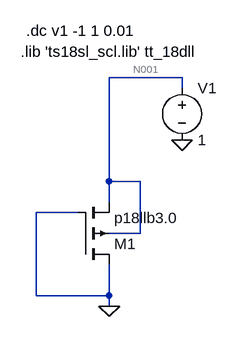
[diagram p0: schematic psuedo.asc]
psuedo.asc, the LTspice schematic file:
Version 4
SHEET 1 880 680
WIRE 352 128 240 128
WIRE 352 144 352 128
WIRE 240 288 240 128
WIRE 288 288 240 288
WIRE 240 320 240 288
WIRE 192 336 128 336
WIRE 288 368 288 288
WIRE 288 368 240 368
WIRE 128 464 128 336
WIRE 240 464 240 416
WIRE 240 464 128 464
WIRE 240 480 240 464
FLAG 240 480 0
FLAG 352 224 0
SYMBOL voltage 352 128 R0
WINDOW 123 0 0 Left 0
WINDOW 39 0 0 Left 0
SYMATTR InstName V1
SYMATTR Value 1
SYMBOL pmos4 192 416 M180
SYMATTR InstName M1
SYMATTR Value p18llb3.0
SYMATTR Value2 l=4u w=4u ad=1.8p as=1.8p pd=8.9u ps=8.9u
TEXT 104 88 Left 2 !.lib 'ts18sl_scl.lib' tt_18dll
TEXT 112 56 Left 2 !.dc v1 -1 1 0.01

The netlist it stands for:
* psuedo.asc
V1 N001 0 1
M1 0 0 N001 N001 p18llb3.0 l=4u w=4u ad=1.8p as=1.8p pd=8.9u ps=8.9u
.model NMOS NMOS
.model PMOS PMOS
.lib standard.mos
.lib 'ts18sl_scl.lib' tt_18dll
.dc v1 -1 1 0.01
.backanno
.end

* Results of the author's LTspice run, read from the files saved beside the schematic
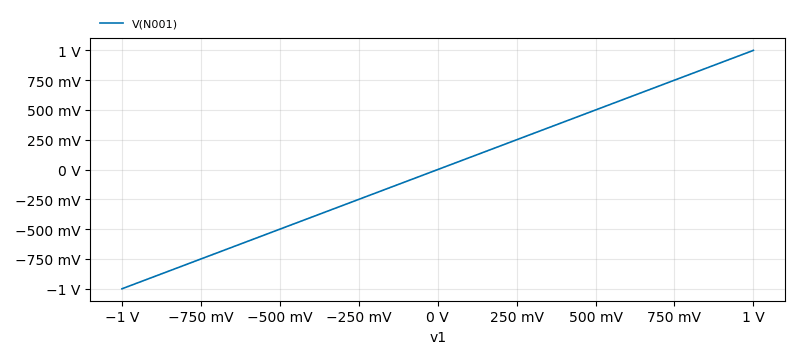
[diagram p1: DC transfer characteristic of psuedo.asc, plotted from the saved traces]
* DC transfer characteristic, 1 run:
*   V(N001): -1 V at v1=-1 V, 1 V at v1=1 V, min -1 V, max 1 V